# EAGLE design Team1_Wetterstation_v2_board1 (EAGLE 9.5.0)
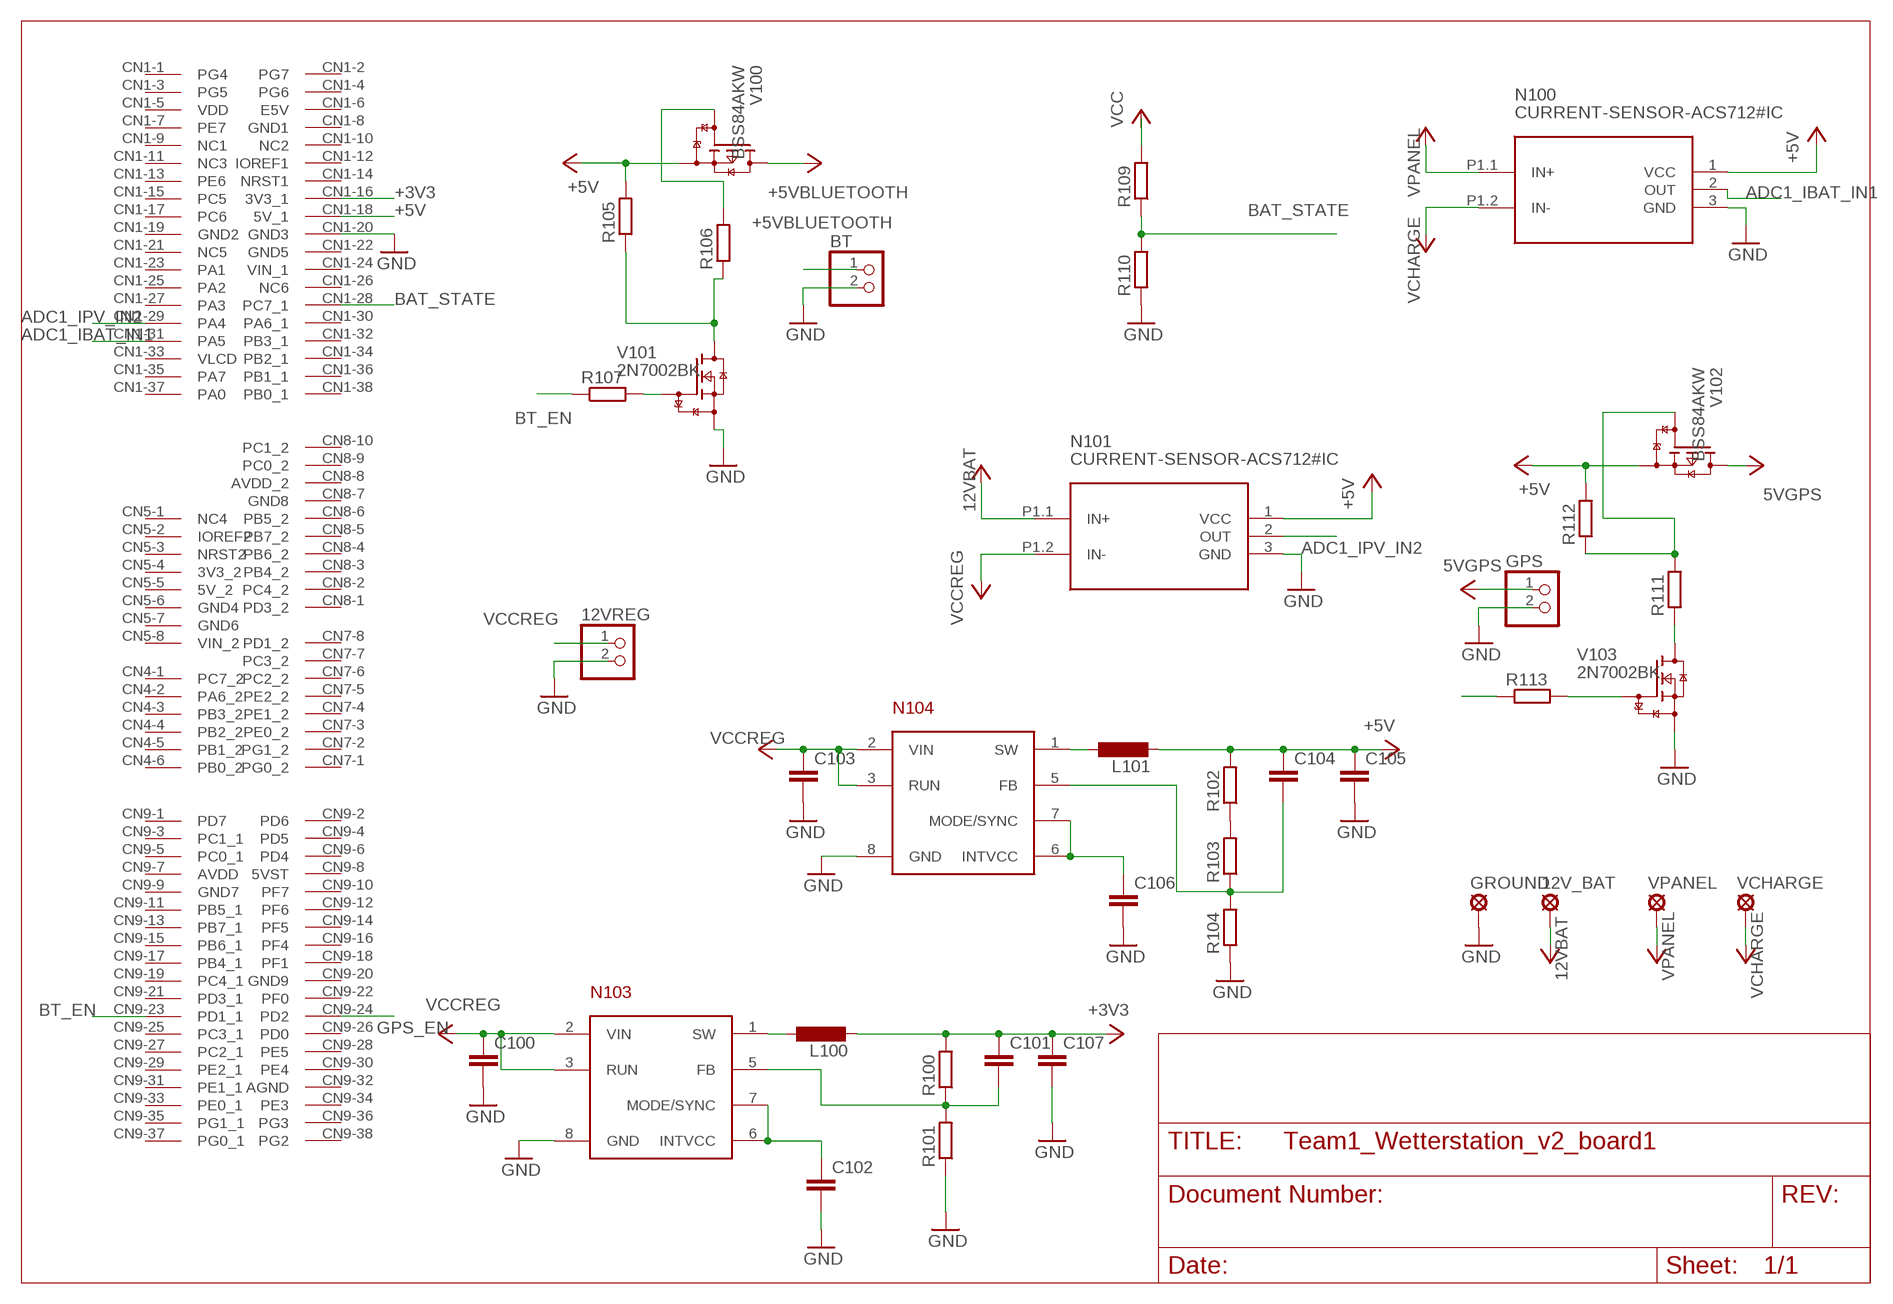
[diagram p0: schematic, sheet 1]

## Parts
12V_BAT  SE14  [SE14]
12VREG  PINHD-1X2  [1X02]
BT  PINHD-1X2  [1X02]
C100  C-EUC0603  [C0603]
C101  C-EUC0603  [C0603]
C102  C-EUC0603  [C0603]
C103  C-EUC0603  [C0603]
C104  C-EUC0603  [C0603]
C105  C-EUC0603  [C0603]
C106  C-EUC0603  [C0603]
C107  C-EUC0603  [C0603]
GPS  PINHD-1X2  [1X02]
GROUND  SE14  [SE14]
L100  L-EU0207/5V  [0207/5V]
L101  L-EU0207/5V  [0207/5V]
N100  CURRENT-SENSOR-ACS712#IC  [CURRENT-SENSOR-ACS712#IC]
N101  CURRENT-SENSOR-ACS712#IC  [CURRENT-SENSOR-ACS712#IC]
N103  LTC3621  [LTC3621FP]
N104  LTC3621  [LTC3621FP]
R100  R-EU_R0603  [R0603]
R101  R-EU_R0603  [R0603]
R102  R-EU_R0603  [R0603]
R103  R-EU_R0603  [R0603]
R104  R-EU_R0603  [R0603]
R105  100k  R-EU_R0603  [R0603]
R106  1k  R-EU_R0603  [R0603]
R107  1k  R-EU_R0603  [R0603]
R109  270k  R-EU_R0603  [R0603]
R110  100k  R-EU_R0603  [R0603]
R111  R-EU_R0603  [R0603]
R112  R-EU_R0603  [R0603]
R113  R-EU_R0603  [R0603]
U$1  NUCLEO-8L152R8  [MODULE_NUCLEO-L053R8]
V100  BSS84AKW  [SOT323]
V101  2N7002BK  [SOT23]
V102  BSS84AKW  [SOT323]
V103  2N7002BK  [SOT23]
VCHARGE  SE14  [SE14]
VPANEL  SE14  [SE14]

## Nets
5VGPS: GPS.1 V102.3(D) ; supply symbol labelled VCC
12VBAT: 12V_BAT.MP N101.P1.1(IN+) R109.2 ; supply symbol labelled VCC
+3V3: C101.1 C107.1 L100.2 R100.2 U$1.CN1-16(3V3_1)
+5V: C104.1 C105.1 L101.2 N100.1(VCC) N101.1(VCC) R102.2 R105.2 R112.2 U$1.CN1-18(5V_1) V100.2(S) V102.2(S)
+5VBLUETOOTH: BT.1 V100.3(D) ; supply symbol labelled +5V
ADC1_IBAT_IN1: N100.2(OUT) U$1.CN1-31(PA5)
ADC1_IPV_IN2: N101.2(OUT) U$1.CN1-29(PA4)
BAT_STATE: R109.1 R110.2 U$1.CN1-28(PC7_1)
BT_EN: R107.1 U$1.CN9-23(PD1_1)
GND: 12VREG.2 BT.2 C100.2 C102.2 C103.2 C105.2 C106.2 C107.2 GPS.2 GROUND.MP N100.3(GND) N101.3(GND) N103.8(GND) N104.8(GND) R101.1 R104.1 R110.1 U$1.CN1-20(GND3) V101.2(S) V103.2(S)
GPS_EN: R113.1 U$1.CN9-24(PD2)
N$1: R106.2 V100.1(G)
N$2: C102.1 N103.6(INTVCC) N103.7(MODE/SYNC)
N$3: R107.2 V101.1(G)
N$4: R105.1 R106.1 V101.3(D)
N$5: L100.1 N103.1(SW)
N$10: L101.1 N104.1(SW)
N$11: C101.2 N103.5(FB) R100.1 R101.2
N$12: C106.1 N104.6(INTVCC) N104.7(MODE/SYNC)
N$13: R102.1 R103.2
N$14: C104.2 N104.5(FB) R103.1 R104.2
N$18: R113.2 V103.1(G)
N$19: R111.1 V103.3(D)
N$20: R111.2 R112.1 V102.1(G)
VCCREG: 12VREG.1 C100.1 C103.1 N101.P1.2(IN-) N103.2(VIN) N103.3(RUN) N104.2(VIN) N104.3(RUN) ; supply symbol labelled VCC
VCHARGE: N100.P1.2(IN-) VCHARGE.MP ; supply symbol labelled VCC
VPANEL: N100.P1.1(IN+) VPANEL.MP ; supply symbol labelled VCC
Unconnected: U$1.CN1-1(PG4) U$1.CN1-2(PG7) U$1.CN1-3(PG5) U$1.CN1-4(PG6) U$1.CN1-5(VDD) U$1.CN1-6(E5V) U$1.CN1-7(PE7) U$1.CN1-8(GND1) U$1.CN1-9(NC1) U$1.CN1-10(NC2) U$1.CN1-11(NC3) U$1.CN1-12(IOREF1) U$1.CN1-13(PE6) U$1.CN1-14(NRST1) U$1.CN1-15(PC5) U$1.CN1-17(PC6) U$1.CN1-19(GND2) U$1.CN1-21(NC5) U$1.CN1-22(GND5) U$1.CN1-23(PA1) U$1.CN1-24(VIN_1) U$1.CN1-25(PA2) U$1.CN1-26(NC6) U$1.CN1-27(PA3) U$1.CN1-30(PA6_1) U$1.CN1-32(PB3_1) U$1.CN1-33(VLCD) U$1.CN1-34(PB2_1) U$1.CN1-35(PA7) U$1.CN1-36(PB1_1) U$1.CN1-37(PA0) U$1.CN1-38(PB0_1) U$1.CN4-1(PC7_2) U$1.CN4-2(PA6_2) U$1.CN4-3(PB3_2) U$1.CN4-4(PB2_2) U$1.CN4-5(PB1_2) U$1.CN4-6(PB0_2) U$1.CN5-1(NC4) U$1.CN5-2(IOREF2) U$1.CN5-3(NRST2) U$1.CN5-4(3V3_2) U$1.CN5-5(5V_2) U$1.CN5-6(GND4) U$1.CN5-7(GND6) U$1.CN5-8(VIN_2) U$1.CN7-1(PG0_2) U$1.CN7-2(PG1_2) U$1.CN7-3(PE0_2) U$1.CN7-4(PE1_2) U$1.CN7-5(PE2_2) U$1.CN7-6(PC2_2) U$1.CN7-7(PC3_2) U$1.CN7-8(PD1_2) U$1.CN8-1(PD3_2) U$1.CN8-2(PC4_2) U$1.CN8-3(PB4_2) U$1.CN8-4(PB6_2) U$1.CN8-5(PB7_2) U$1.CN8-6(PB5_2) U$1.CN8-7(GND8) U$1.CN8-8(AVDD_2) U$1.CN8-9(PC0_2) U$1.CN8-10(PC1_2) U$1.CN9-1(PD7) U$1.CN9-2(PD6) U$1.CN9-3(PC1_1) U$1.CN9-4(PD5) U$1.CN9-5(PC0_1) U$1.CN9-6(PD4) U$1.CN9-7(AVDD) U$1.CN9-8(5VST) U$1.CN9-9(GND7) U$1.CN9-10(PF7) U$1.CN9-11(PB5_1) U$1.CN9-12(PF6) U$1.CN9-13(PB7_1) U$1.CN9-14(PF5) U$1.CN9-15(PB6_1) U$1.CN9-16(PF4) U$1.CN9-17(PB4_1) U$1.CN9-18(PF1) U$1.CN9-19(PC4_1) U$1.CN9-20(GND9) U$1.CN9-21(PD3_1) U$1.CN9-22(PF0) U$1.CN9-25(PC3_1) U$1.CN9-26(PD0) U$1.CN9-27(PC2_1) U$1.CN9-28(PE5) U$1.CN9-29(PE2_1) U$1.CN9-30(PE4) U$1.CN9-31(PE1_1) U$1.CN9-32(AGND) U$1.CN9-33(PE0_1) U$1.CN9-34(PE3) U$1.CN9-35(PG1_1) U$1.CN9-36(PG3) U$1.CN9-37(PG0_1) U$1.CN9-38(PG2)

## Library data of the parts
12V_BAT GROUND VCHARGE VPANEL = solpad:SE14: SOLDER PAD E1553, drill 1,4mm, distributor Buerklin, 07F820
12VREG BT GPS = pinhead:PINHD-1X2: PIN HEADER
C100-C107 = rcl:C-EU: CAPACITOR, European symbol; SPICEPREFIX: C
L100 L101 = rcl:L-EU: INDUCTOR, European symbol; SPICEPREFIX: L
N100 N101 = diy-modules:CURRENT-SENSOR-ACS712#IC: Isolated Bipolar Current Sensors based on ACS712 chip Symbol with input pins More details available here: http://embedded-lab.com/blog/a-brief-overview-of-allegro-acs712-current-sensor-part-1/ Click here to find device on ebay.com <http://www.ebay.com/sch/acs712+module> Note: There are many available versions with different pinout. Please check before use
N103 N104 = SOP65P490X110-8N:LTC3621
R100-R107 R109-R113 = rcl:R-EU_: RESISTOR, European symbol; SPICEPREFIX: R
U$1 = nucleo:NUCLEO-8L152R8
V100 V102 = nxp_60:BSS84A: 50 V, 150 mA P-channel Trench MOSFET P-channel enhancement mode Field-Effect Transistor (FET) in a small Surface-Mounted Device (SMD) plastic package using Trench MOSFET technology. AAL Eindhoven MK
V101 V103 = nxp_60:2N7002B: 60 V, single N-channel Trench MOSFET N-channel enhancement mode Field-Effect Transistor (FET) in a leadless ultra small DFN1006B-3 (SOT883B) Surface-Mounted Device (SMD) plastic package using Trench MOSFET technology. AAL Eindhoven MK

## Board
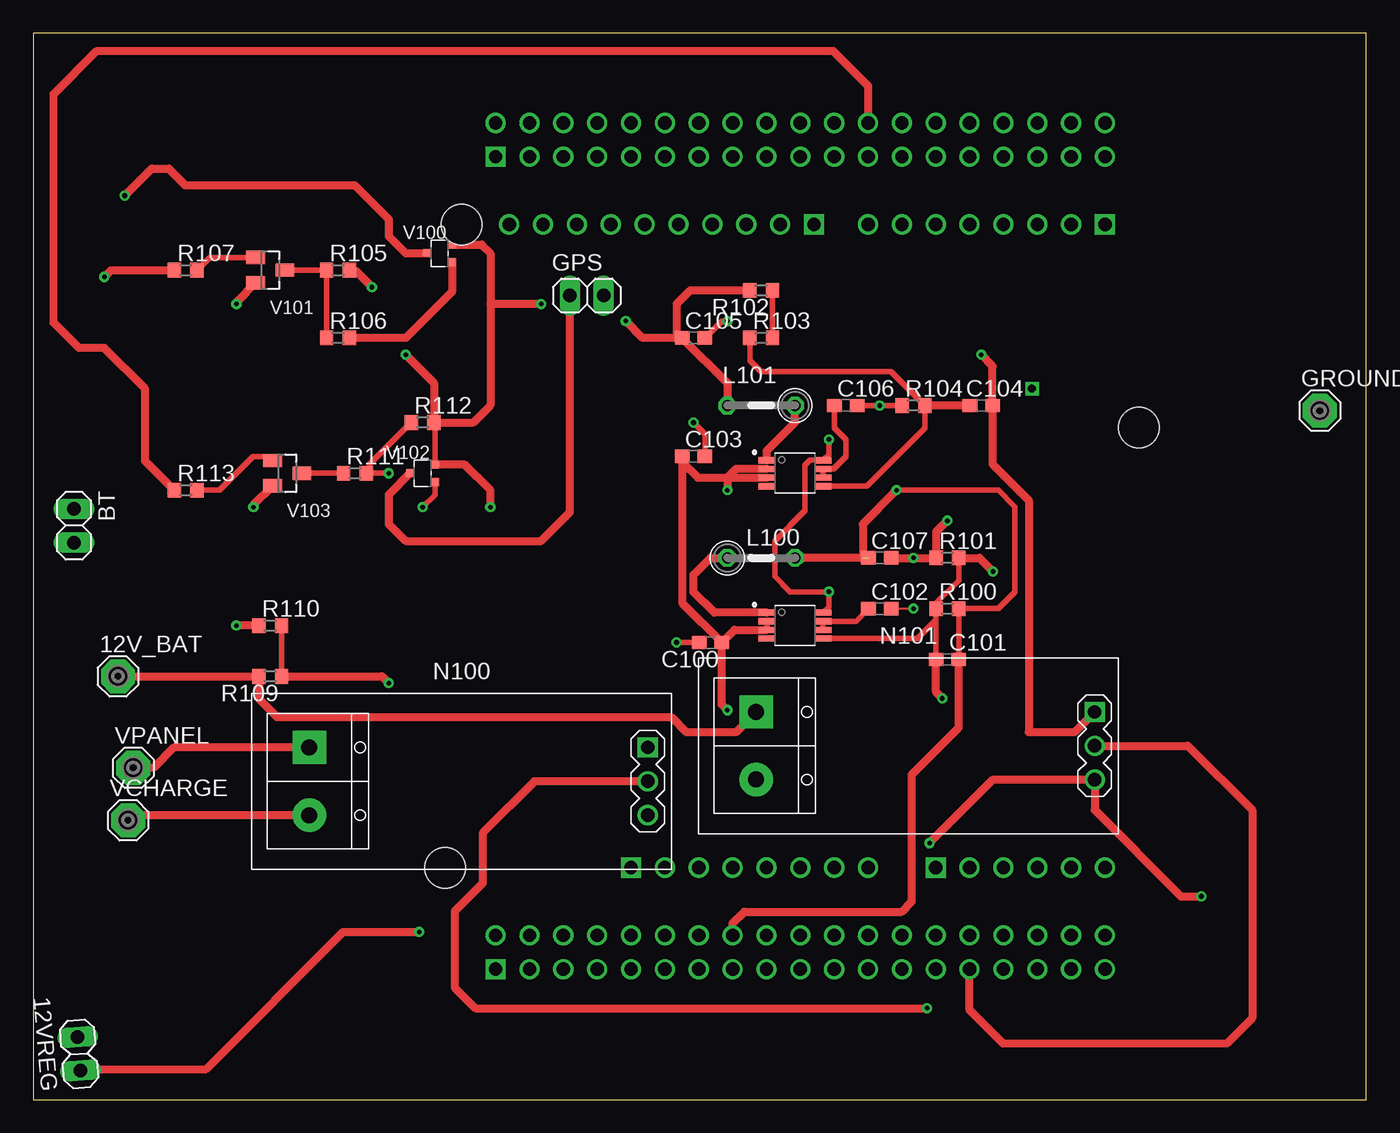
[diagram p1: board, top side]
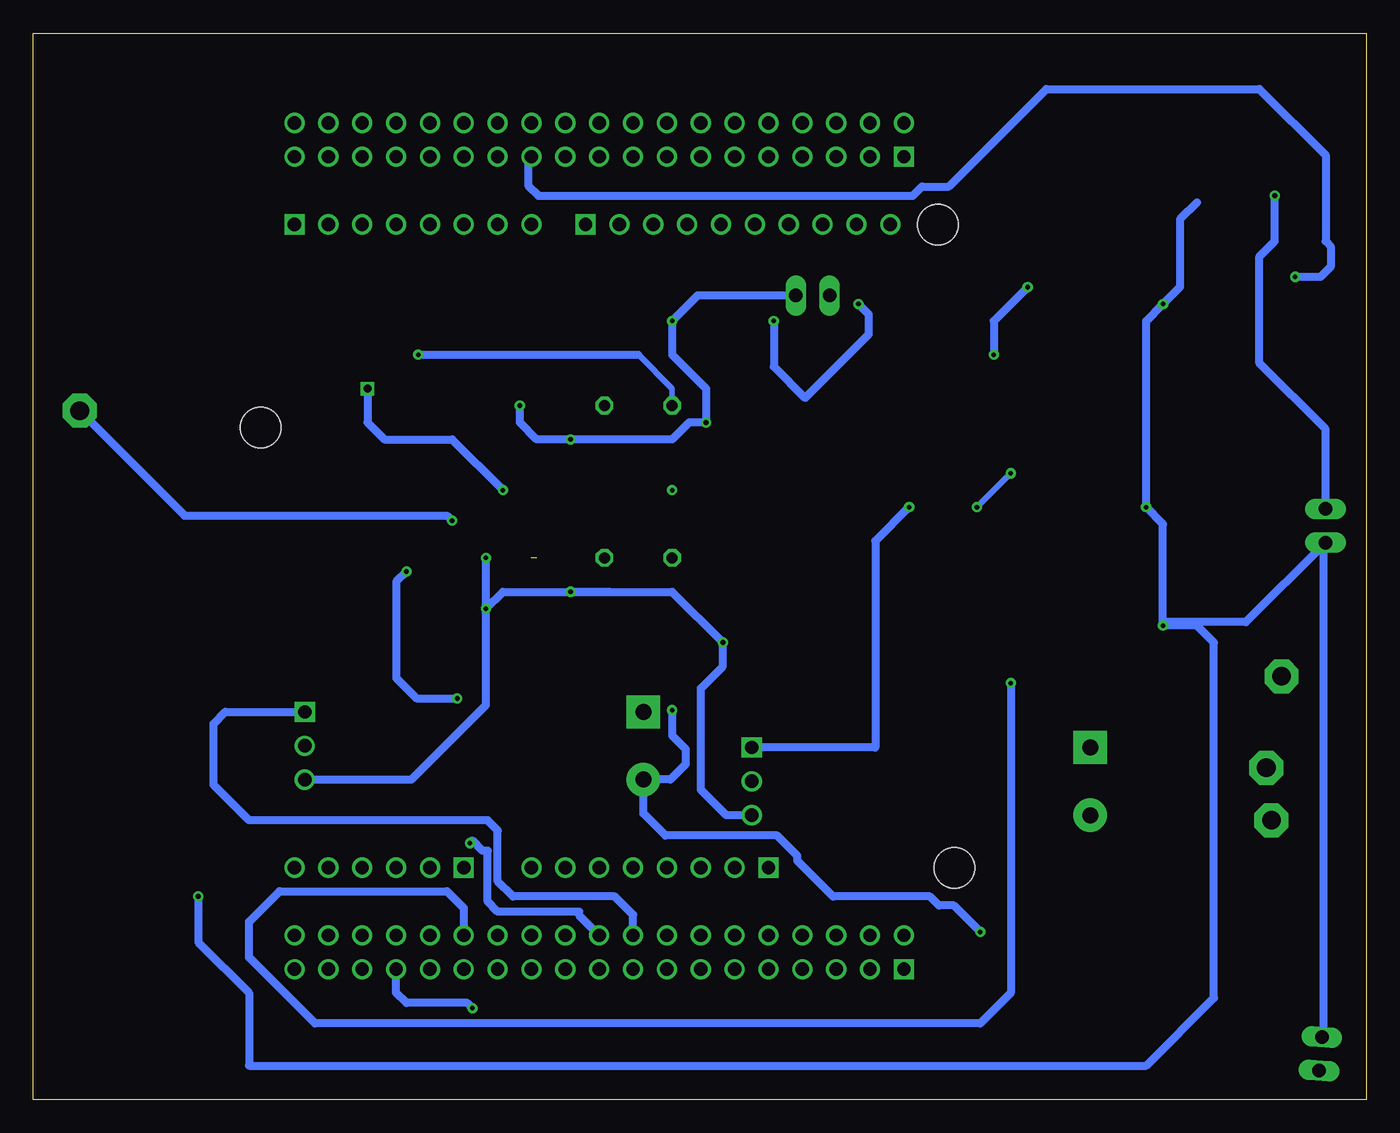
[diagram p2: board, bottom side, seen from below]

Size 100 x 80 mm. Coordinates in mm from the lower left corner, seen from the top.
Outline: 0,0 100,0 100,80 0,80 0,0
Copper layers (1*16): Top 0.035mm / dielectric 1.5mm / Bottom 0.035mm
Design rules "default": minimum track width 6mil, minimum drill 0.35mm, track to track 6mil, track to pad 6mil, pad to pad 6mil, via to via 6mil, smd to smd 6mil, copper to edge 40mil, drill to drill 6mil, minimum pad ring 10mil, minimum via ring 8mil, stop-mask expansion 4mil, vias tented up to drill 0mil, thermal gap 10mil

### Footprints (pad centres in the part's own frame; a part is rotated, then mirrored left to right if it is on the bottom)
SE14 = drill 1.397 pad 2.54 octagon: MP 0,0
1X02 = drill 1.016 long: 1 -1.27,0; 2 1.27,0
C0603 = smd 1.1 x 1: 1 -0.85,0; 2 0.85,0
0207/5V = drill 0.813 octagon: 1 -2.54,0; 2 2.54,0
CURRENT-SENSOR-ACS712#IC = drill 1 square: 1 13.97,2.54 | drill 1: 2 13.97,0; 3 13.97,-2.54 | drill 1.2 pad 2.5 square: P1.1 -11.43,2.54 | drill 1.2 pad 2.5: P1.2 -11.43,-2.54
LTC3621FP = smd 1.25 x 0.46: 1 -2.11,0.975; 2 -2.11,0.325; 3 -2.11,-0.325; 4 -2.11,-0.975; 5 2.11,-0.975; 6 2.11,-0.325; 7 2.11,0.325; 8 2.11,0.975
R0603 = smd 1 x 1.1: 1 -0.85,0; 2 0.85,0
MODULE_NUCLEO-L053R8 = drill 1 square: CN1-1 -31.75,9.51; CN4-1 -24.13,-23.51; CN5-1 -24.13,-0.65; CN7-1 24.13,-36.21; CN8-1 24.13,-14.37; CN9-1 29.21,9.51 | drill 1: CN1-2 -29.21,9.51; CN1-3 -31.75,6.97; CN1-4 -29.21,6.97; CN1-5 -31.75,4.43; CN1-6 -29.21,4.43; CN1-7 -31.75,1.89; CN1-8 -29.21,1.89; CN1-9 -31.75,-0.65; CN1-10 -29.21,-0.65; CN1-11 -31.75,-3.19; CN1-12 -29.21,-3.19; CN1-13 -31.75,-5.73; CN1-14 -29.21,-5.73; CN1-15 -31.75,-8.27; CN1-16 -29.21,-8.27; CN1-17 -31.75,-10.81; CN1-18 -29.21,-10.81; CN1-19 -31.75,-13.35; CN1-20 -29.21,-13.35; CN1-21 -31.75,-15.89; CN1-22 -29.21,-15.89; CN1-23 -31.75,-18.43; CN1-24 -29.21,-18.43; CN1-25 -31.75,-20.97; CN1-26 -29.21,-20.97; CN1-27 -31.75,-23.51; CN1-28 -29.21,-23.51; CN1-29 -31.75,-26.05; CN1-30 -29.21,-26.05; CN1-31 -31.75,-28.59; CN1-32 -29.21,-28.59; CN1-33 -31.75,-31.13; CN1-34 -29.21,-31.13; CN1-35 -31.75,-33.67; CN1-36 -29.21,-33.67; CN1-37 -31.75,-36.21; CN1-38 -29.21,-36.21; CN4-2 -24.13,-26.05; CN4-3 -24.13,-28.59; CN4-4 -24.13,-31.13; CN4-5 -24.13,-33.67; CN4-6 -24.13,-36.21; CN5-2 -24.13,-3.19; CN5-3 -24.13,-5.73; CN5-4 -24.13,-8.27; CN5-5 -24.13,-10.81; CN5-6 -24.13,-13.35; CN5-7 -24.13,-15.89; CN5-8 -24.13,-18.43; CN7-2 24.13,-33.67; CN7-3 24.13,-31.13; CN7-4 24.13,-28.59; CN7-5 24.13,-26.05; CN7-6 24.13,-23.51; CN7-7 24.13,-20.97; CN7-8 24.13,-18.43; CN8-2 24.13,-11.83; CN8-3 24.13,-9.29; CN8-4 24.13,-6.75; CN8-5 24.13,-4.21; CN8-6 24.13,-1.67; CN8-7 24.13,0.87; CN8-8 24.13,3.41; CN8-9 24.13,5.95; CN8-10 24.13,8.49; CN9-2 31.75,9.51; CN9-3 29.21,6.97; CN9-4 31.75,6.97; CN9-5 29.21,4.43; CN9-6 31.75,4.43; CN9-7 29.21,1.89; CN9-8 31.75,1.89; CN9-9 29.21,-0.65; CN9-10 31.75,-0.65; CN9-11 29.21,-3.19; CN9-12 31.75,-3.19; CN9-13 29.21,-5.73; CN9-14 31.75,-5.73; CN9-15 29.21,-8.27; CN9-16 31.75,-8.27; CN9-17 29.21,-10.81; CN9-18 31.75,-10.81; CN9-19 29.21,-13.35; CN9-20 31.75,-13.35; CN9-21 29.21,-15.89; CN9-22 31.75,-15.89; CN9-23 29.21,-18.43; CN9-24 31.75,-18.43; CN9-25 29.21,-20.97; CN9-26 31.75,-20.97; CN9-27 29.21,-23.51; CN9-28 31.75,-23.51; CN9-29 29.21,-26.05; CN9-30 31.75,-26.05; CN9-31 29.21,-28.59; CN9-32 31.75,-28.59; CN9-33 29.21,-31.13; CN9-34 31.75,-31.13; CN9-35 29.21,-33.67; CN9-36 31.75,-33.67; CN9-37 29.21,-36.21; CN9-38 31.75,-36.21 | hole 3.05: 24.13,12.05; -24.13,13.32; 8.89,-38.75
SOT323 = smd 0.6 x 0.6: 1 -0.65,-0.925; 2 0.65,-0.925; 3 0,0.925
SOT23 = smd 1 x 1.4: 1 -0.95,-1.1; 2 0.95,-1.1; 3 0,1.1

### Placement (x,y rotation side)
12V_BAT  6.35,31.75 0 top
12VREG  3.43,3.43 94.7 top
BT  3.05,43.05 270 top
C100  50.8,34.29 180 top
C101  68.58,33.02 180 top
C102  63.5,36.83 0 top
C103  49.53,48.26 0 top
C104  71.12,52.07 180 top
C105  49.53,57.15 0 top
C106  60.96,52.07 0 top
C107  63.5,40.64 0 top
GPS  41.53,60.33 0 top
GROUND  96.52,51.69 0 top
L100  54.61,40.64 0 top
L101  54.61,52.07 180 top
N100  32.13,23.88 0 top
N101  65.66,26.54 0 top
N103  57.15,35.56 0 top
N104  57.15,46.99 0 top
R100  68.58,36.83 0 top
R101  68.58,40.64 0 top
R102  54.61,60.71 180 top
R103  54.61,57.15 0 top
R104  66.04,52.07 0 top
R105  22.86,62.23 0 top
R106  22.86,57.15 0 top
R107  11.43,62.23 0 top
R109  17.78,31.75 180 top
R110  17.78,35.56 0 top
R111  24.13,46.99 0 top
R112  29.21,50.8 0 top
R113  11.43,45.72 0 top
U$1  44.2,41.53 90 top
V100  30.48,63.5 90 top
V101  17.78,62.23 270 top
V102  29.21,46.99 90 top
V103  19.05,46.99 270 top
VCHARGE  7.11,20.95 0 top
VPANEL  7.49,24.89 0 top

### Tracks (layer width: path | path; a pad name or v marks a point on that pad's centre or on a via)
5VGPS
  Top 0.61: GPS.1 40.26,44.07 38.1,41.91 27.94,41.91 26.67,43.18 26.67,45.38 V102.3
12VBAT
  Top 0.61: 12V_BAT.MP R109.2 16.93,30.06 18.29,28.7 47.88,28.7 49.02,27.56 52.7,27.56 N101.P1.1
+3V3  (via drill 0.35, 0.6)  (1 unrouted)
  Top 0.406: C101.1 R100.2 72.39,36.83 73.66,38.1 73.66,44.45 72.39,45.72 v64.77,45.72
  Top 0.61: 62.23,40.64 62.23,43.18 v64.77,45.72 | C107.1 L100.2 | U$1.CN1-16 52.47,13.22 53.34,14.1 65.15,14.1 65.91,14.86 65.91,24.38 69.43,27.9 C101.1
  Bottom 0.61: v64.77,45.72 68.58,49.53 73.66,49.53 74.93,50.8 v74.93,53.34
+5V  (via drill 0.35)
  Top 0.152: C105.1 48.26,57.15 | 30.14,50.73 R112.2
  Top 0.406: V102.2 30.14,50.73
  Top 0.61: v34.29,44.45 34.29,45.72 32.37,47.64 V102.2 | C105.1 52.07,53.76 L101.2 | v44.45,58.42 45.72,57.15 48.26,57.15 48.26,59.69 49.28,60.71 R102.2 | v38.1,59.69 34.29,59.69 | v71.12,55.88 71.97,55.03 C104.1 71.97,47.66 74.68,44.96 74.68,27.56 78.11,27.56 N101.1 | R105.2 24.13,62.23 v25.4,60.96 | v27.94,55.88 30.06,53.76 R112.2 33.02,50.8 34.29,52.07 34.29,59.69 | V100.2 33.64,64.15 34.29,63.5 34.29,59.69
  Bottom 0.406: L101.2 52.07,53.34 54.61,55.88
  Bottom 0.61: v34.29,44.45 36.83,41.91 36.83,26.42 N100.1 | v44.45,58.42 44.45,54.99 42.1,52.64 37.34,57.4 37.34,58.93 v38.1,59.69 | v71.12,55.88 54.61,55.88 | v25.4,60.96 27.94,58.42 v27.94,55.88 | U$1.CN1-18 55.01,13.86 56.39,15.24 64.01,15.24 65.15,16.38 65.15,20.19 65.91,20.95 83.82,20.95 86.49,23.62 86.49,28.19 85.6,29.08 N101.1
+5VBLUETOOTH  (via drill 0.35)
  Top 0.61: V100.3 27.94,63.5 26.67,64.77 26.67,66.04 24.13,68.58 11.43,68.58 10.16,69.85 8.89,69.85 v6.86,67.82
  Bottom 0.61: BT.1 3.05,50.29 8,55.24 8,63.25 6.86,64.39 v6.86,67.82
ADC1_IBAT_IN1  (via drill 0.35)
  Top 0.61: N100.2 37.59,23.88 33.72,20.01 33.72,16.22 31.62,14.12 31.62,8.38 33.15,6.86 v67.06,6.86
  Bottom 0.61: v67.06,6.86 67.44,7.24 72.01,7.24 72.79,8.02 U$1.CN1-31
ADC1_IPV_IN2
  Top 0.61: N101.2 86.61,26.54 91.44,21.72 91.44,6.1 89.53,4.19 72.77,4.19 70.25,6.72 U$1.CN1-29
BAT_STATE  (via drill 0.35)
  Top 0.406: R109.1 R110.2
  Top 0.61: R109.1 26.16,31.75 v26.67,31.24
  Bottom 0.61: v26.67,31.24 26.67,8 28.96,5.71 78.87,5.71 83.82,10.67 83.82,13.34 81.53,15.62 68.96,15.62 67.71,14.37 U$1.CN1-28
BT_EN  (via drill 0.35)
  Top 0.61: v5.33,61.72 5.84,62.23 R107.1
  Bottom 0.61: U$1.CN9-23 62.87,70.5 62.87,68.58 62.1,67.82 34.01,67.82 33.33,68.5 31.32,68.5 24,75.82 8,75.82 3.05,70.87 3.05,64.39 2.67,64.01 2.67,62.48 3.43,61.72 v5.33,61.72
GND  (via drill 0.35)
  Top 0.152: 15.24,59.84 v15.24,59.69 | 16.51,44.6 v16.51,44.45 | C102.2 v66.04,36.83
  Top 0.406: C100.2 v48.26,34.29 | N103.8 59.69,36.97 v59.69,38.1 56.77,38.1 55.63,39.24 55.63,41.91 57.91,44.2 57.91,47.62 58.25,47.97 N104.8 59.69,48.4 v59.69,49.53 | C106.2 v63.5,52.07 R104.1 | C103.2 50.38,49.95 v49.53,50.8 | C105.2 51.65,58.42 v52.07,58.42
  Top 0.61: V101.2 15.24,59.84 | V103.2 16.51,44.6 | R110.1 v15.24,35.56 | v87.63,15.24 86.11,15.24 79.63,21.72 N101.3 72.01,24 v67.25,19.24 | C107.2 v66.04,40.64 R101.1 67.73,42.58 v68.58,43.43
  Bottom 0.61: 12.7,67.31 13.97,66.04 13.97,60.96 v15.24,59.69 16.51,58.42 v16.51,44.45 15.24,43.18 15.24,35.81 | GPS.2 50.16,60.33 v52.07,58.42 52.07,55.88 49.53,53.34 v49.53,50.8 50.8,50.8 52.07,49.53 v59.69,49.53 62.23,49.53 63.5,50.8 v63.5,52.07 | v66.04,36.83 v66.04,40.64 | v66.04,36.83 64.77,38.1 v59.69,38.1 | v87.63,15.24 87.63,11.81 83.82,8 83.82,2.54 16.51,2.54 11.43,7.62 11.43,34.29 12.7,35.56 v15.24,35.56 15.24,35.81 | 56.77,38.1 v59.69,38.1 | v59.69,38.1 52.07,38.1 v48.26,34.29 48.26,32.51 49.91,30.86 49.91,23.24 48.01,21.34 N100.3 | N101.3 71.63,24 66.04,29.59 v66.04,36.83 | BT.2 3.17,41.66 | 3.17,41.66 9.02,35.81 15.24,35.81 | U$1.CN1-20 59.05,13.83 59.05,14.1 65.15,14.1 65.91,14.86 65.91,18.67 66.29,18.67 67.06,19.43 v67.25,19.24 | GROUND.MP 88.65,43.81 68.96,43.81 v68.58,43.43 | 12VREG.2 3.17,4.84 3.17,41.66
GPS_EN
  Top 0.61: R113.1 8.38,47.92 8.38,53.34 5.33,56.39 3.43,56.39 1.52,58.29 1.52,75.44 4.76,78.68 60.01,78.68 62.63,76.06 U$1.CN9-24
N$1
  Top 0.61: V100.1 31.41,60.62 27.94,57.15 R106.2
N$2
  Top 0.406: C102.1 61.7,35.88 N103.7 N103.6
N$3
  Top 0.406: R107.2 13.23,63.18 V101.1
N$4
  Top 0.406: V101.3 R105.1 R106.1
N$5
  Top 0.61: N103.1 51.09,36.53 49.53,38.1 49.53,39.37 50.8,40.64 L100.1
N$10
  Top 0.61: L101.1 57.15,50.8 55.04,48.69 N104.1
N$11  (via drill 0.35)
  Top 0.152: 67.73,35.98 R100.1 67.73,37.25 | 67.73,33.44 67.31,33.02
  Top 0.406: N103.5 66.33,34.59 67.73,35.98 | R101.2 69.43,38.95 67.73,37.25 | R100.1 67.73,33.44
  Top 0.61: R101.2 70.99,40.64 v72.01,39.62 | v68.2,30.1 67.73,30.57 C101.2
  Bottom 0.61: v72.01,39.62 72.77,38.86 72.77,31.62 71.25,30.1 v68.2,30.1
N$12
  Top 0.406: C106.1 60.11,50.38 60.96,49.53 60.96,48.26 60.02,47.31 N104.7 N104.6
N$13
  Top 0.406: R103.2 R102.1
N$14
  Top 0.406: N104.5 62.52,46.02 66.89,50.38 R104.2 64.35,54.61 54.61,54.61 53.76,55.46 R103.1
  Top 0.61: C104.2 R104.2
N$18
  Top 0.152: 17.63,48.26 V103.1
  Top 0.406: R113.2 13.97,45.72 16.51,48.26 17.63,48.26
N$19
  Top 0.406: R111.1 V103.3
N$20  (via drill 0.35)
  Top 0.152: R111.2 25.19,47.2 25.4,46.99 | 28.29,50.73 R112.1
  Top 0.406: R112.1 25.19,47.63 25.19,47.2 | V102.1 30.14,45.38 v29.21,44.45 | v26.67,46.99 25.4,46.99
  Bottom 0.406: v29.21,44.45 v26.67,46.99
VCCREG  (via drill 0.35)
  Top 0.152: C103.1 48.68,47.84
  Top 0.406: N103.3 N103.2
  Top 0.61: v52.07,29.21 51.65,29.63 C100.1 | 52.07,46.66 49.85,46.66 48.68,47.84 | 52.07,46.66 N104.3 | N104.2 52.72,47.31 52.07,46.66 | C103.1 48.68,37.26 C100.1 | 52.07,46.66 v52.07,45.72 | C100.1 52.59,35.23 N103.3 | 12VREG.1 3.66,2.29 12.95,2.29 23.24,12.57 v28.96,12.57
  Bottom 0.61: v52.07,29.21 52.07,27.3 51.05,26.29 51.05,25.15 52.2,24 N101.P1.2 54.23,21.46 52.58,19.81 44.2,19.81 42.67,18.29 42.67,17.91 40.01,15.24 32.74,15.24 32.05,14.55 30.94,14.55 v28.96,12.57
VCHARGE
  Top 0.61: N100.P1.2 7.49,21.34 VCHARGE.MP
VPANEL
  Top 0.61: N100.P1.1 10.54,26.42 9.02,24.89 VPANEL.MP

### Text on the board
Document: EN | VCC | GND | TXD | RXD | STA | 5VGPS | GND | BT_EN | GPS_EN | N104 | BAT_STATE | N103 | 12V BAT | 5V | CHG_OUT | GND | BAT_IN